# EAGLE design ATmega328p-DHT11-DS1307-LCD-StripBd (EAGLE 9.2.2)
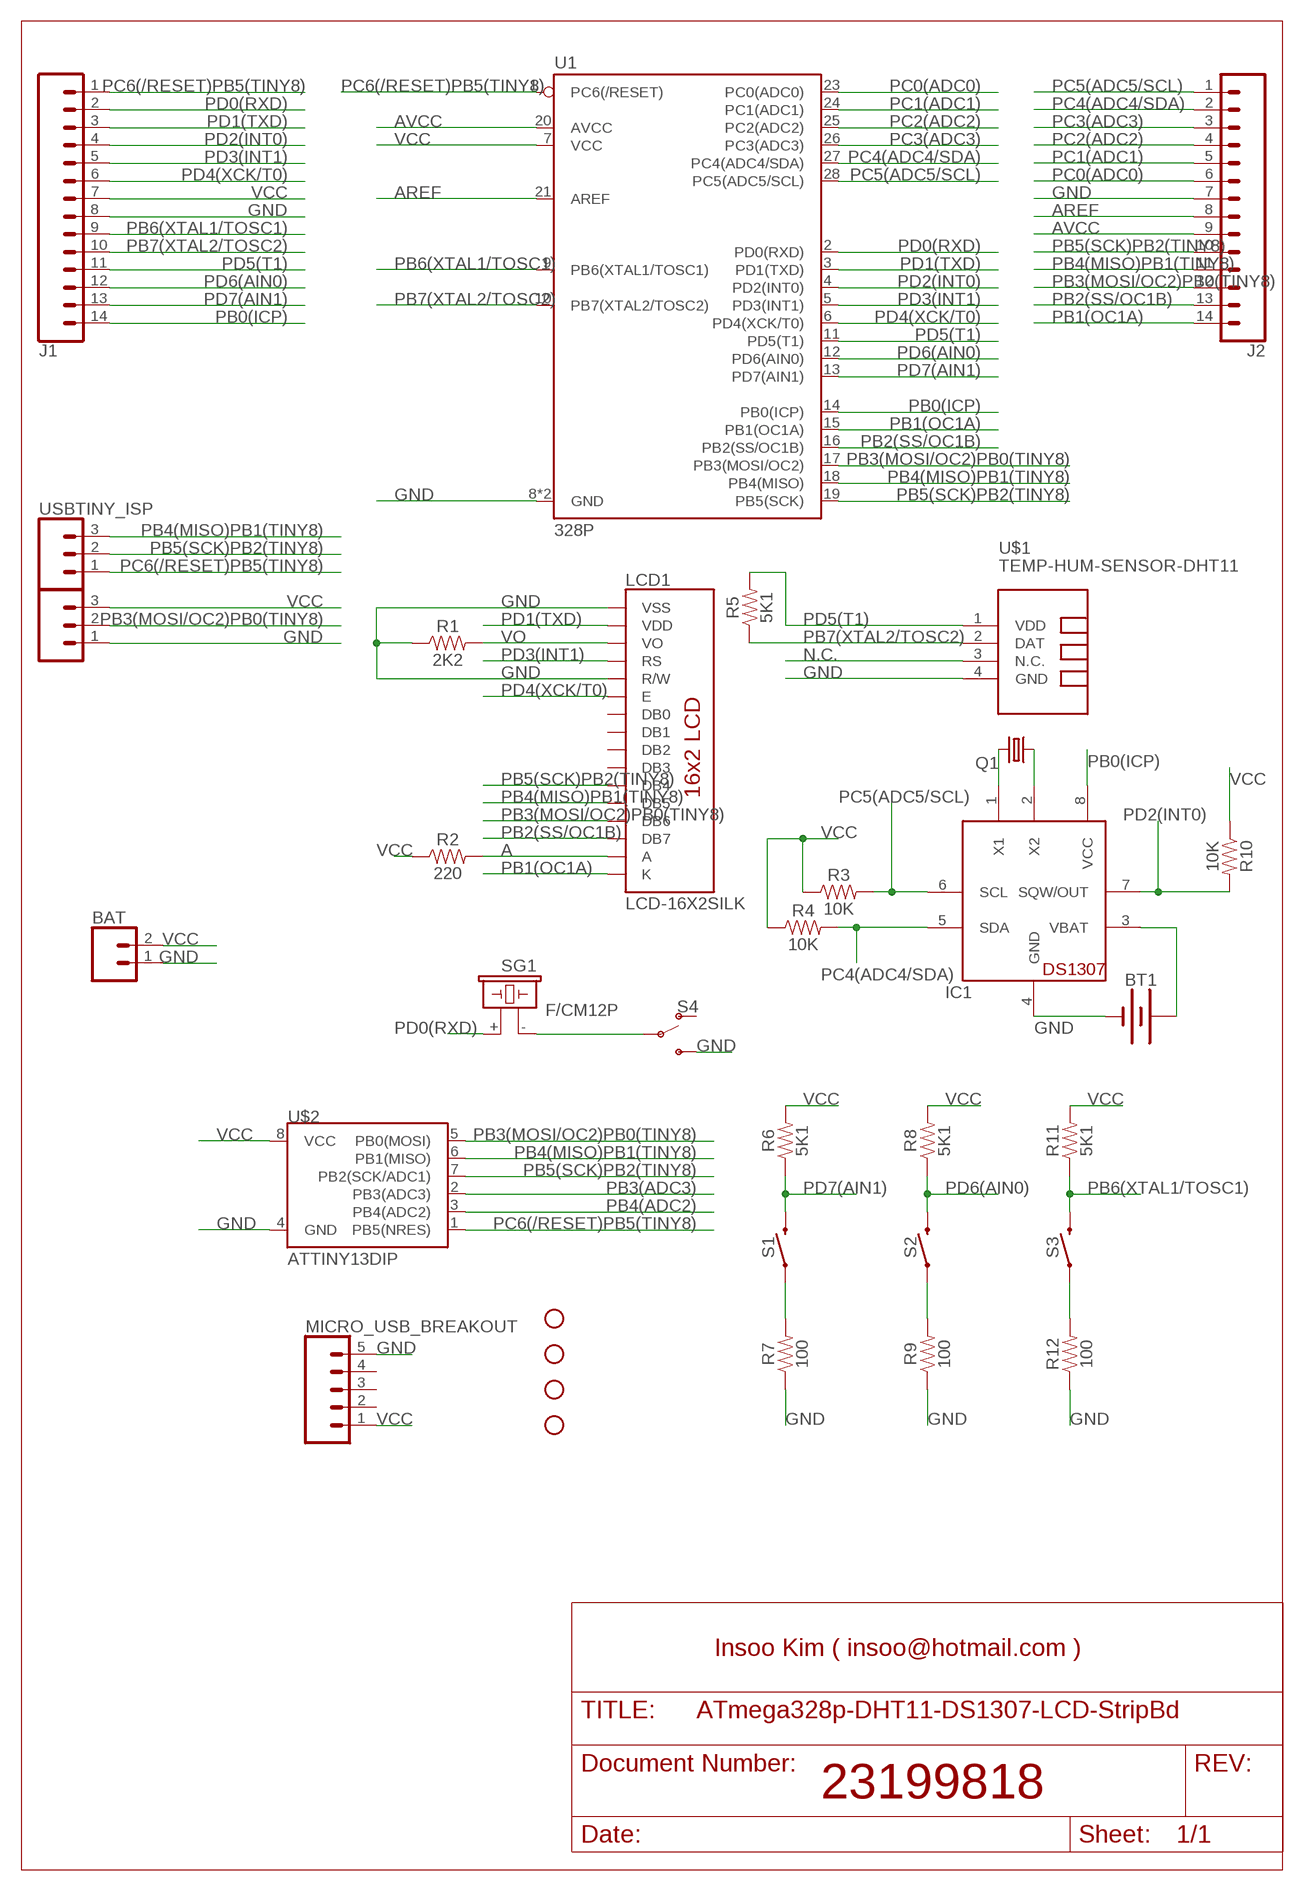
[diagram p0: schematic, sheet 1]

## Parts
BAT  CONN_02  [1X02]
BT1  BATTERY-20MM_PTH  [BATTCOM_20MM_PTH]
H1  STAND-OFF  [STAND-OFF]
H2  STAND-OFF  [STAND-OFF]
H3  STAND-OFF  [STAND-OFF]
H4  STAND-OFF  [STAND-OFF]
IC1  DS1307  [DIL08]
J1  CONN_14  [1X14]
J2  CONN_14  [1X14]
J3  455-1750-1-ND  CONN_03  [1X03]
LCD1  LCD-16X2SILK  [LCD-16X2]
MICRO_USB_BREAKOUT  CONN_05  [1X05]
Q1  CRYSTALTC26H  [TC26H]
R1  2K2  1KOHM-HORIZ-1/4W-5%  [AXIAL-0.3]
R2  220  1KOHM-HORIZ-1/4W-5%  [AXIAL-0.3]
R3  10K  1KOHM-HORIZ-1/4W-5%  [AXIAL-0.3]
R4  10K  1KOHM-HORIZ-1/4W-5%  [AXIAL-0.3]
R5  5K1  1KOHM-HORIZ-1/4W-5%  [AXIAL-0.3]
R6  5K1  1KOHM-HORIZ-1/4W-5%  [AXIAL-0.3]
R7  100  1KOHM-HORIZ-1/4W-5%  [AXIAL-0.3]
R8  5K1  1KOHM-HORIZ-1/4W-5%  [AXIAL-0.3]
R9  100  1KOHM-HORIZ-1/4W-5%  [AXIAL-0.3]
R10  10K  1KOHM-HORIZ-1/4W-5%  [AXIAL-0.3]
R11  5K1  1KOHM-HORIZ-1/4W-5%  [AXIAL-0.3]
R12  100  1KOHM-HORIZ-1/4W-5%  [AXIAL-0.3]
S1  MOMENTARY-SWITCH-SPST-PTH-12MM  [TACTILE_SWITCH_PTH_12MM]
S2  MOMENTARY-SWITCH-SPST-PTH-12MM  [TACTILE_SWITCH_PTH_12MM]
S3  MOMENTARY-SWITCH-SPST-PTH-12MM  [TACTILE_SWITCH_PTH_12MM]
S4  SWITCH-SPDT-PTH-11.6X4.0MM  [SWITCH_SPDT_PTH_11.6X4.0MM]
SG1  F/CM12P  [F/CM12P]
U1  328P  ATMEGA328P_PDIP  [DIP28]
U$1  TEMP-HUM-SENSOR-DHT11  [TEMP-HUM-SENSOR-DHT11]
U$2  ATTINY13DIP  [DIP08_MCU]
USBTINY_ISP  455-1750-1-ND  CONN_03  [1X03]

## Nets
A: LCD1.15(A) R2.P$2
AREF: J2.8 U1.21(AREF)
AVCC: J2.9 U1.20(AVCC)
GND: BAT.1 BT1.2(-) IC1.4(GND) J1.8 J2.7 J3.1 LCD1.1(VSS) LCD1.5(R/W) MICRO_USB_BREAKOUT.5 R1.P$1 R7.P$1 R9.P$1 R12.P$1 S4.3(S) U1.8(GND) U1.22(GND) U$1.4(GND) U$2.4(GND)
N$1: R12.P$2 S3.1
N$2: S4.2(P) SG1.-
N$40: R7.P$2 S1.1
N$54: IC1.2(X2) Q1.1
N$55: IC1.1(X1) Q1.2
N$56: R9.P$2 S2.1
N$58: BT1.1(+) IC1.3(VBAT)
N.C.: U$1.3(N.C.)
PB0(ICP): IC1.8(VCC) J1.14 U1.14(PB0(ICP))
PB1(OC1A): J2.14 LCD1.16(K) U1.15(PB1(OC1A))
PB2(SS/OC1B): J2.13 LCD1.14(DB7) U1.16(PB2(SS/OC1B))
PB3(ADC3): U$2.2(PB3(ADC3))
PB3(MOSI/OC2)PB0(TINY8): J2.12 J3.2 LCD1.13(DB6) U1.17(PB3(MOSI/OC2)) U$2.5(PB0(MOSI))
PB4(ADC2): U$2.3(PB4(ADC2))
PB4(MISO)PB1(TINY8): J2.11 LCD1.12(DB5) U1.18(PB4(MISO)) U$2.6(PB1(MISO)) USBTINY_ISP.3
PB5(SCK)PB2(TINY8): J2.10 LCD1.11(DB4) U1.19(PB5(SCK)) U$2.7(PB2(SCK/ADC1)) USBTINY_ISP.2
PB6(XTAL1/TOSC1): J1.9 R11.P$1 S3.3 U1.9(PB6(XTAL1/TOSC1))
PB7(XTAL2/TOSC2): J1.10 R5.P$1 U1.10(PB7(XTAL2/TOSC2)) U$1.2(DAT)
PC0(ADC0): J2.6 U1.23(PC0(ADC0))
PC1(ADC1): J2.5 U1.24(PC1(ADC1))
PC2(ADC2): J2.4 U1.25(PC2(ADC2))
PC3(ADC3): J2.3 U1.26(PC3(ADC3))
PC4(ADC4/SDA): IC1.5(SDA) J2.2 R4.P$2 U1.27(PC4(ADC4/SDA))
PC5(ADC5/SCL): IC1.6(SCL) J2.1 R3.P$2 U1.28(PC5(ADC5/SCL))
PC6(/RESET)PB5(TINY8): J1.1 U1.1(PC6(/RESET)) U$2.1(PB5(NRES)) USBTINY_ISP.1
PD0(RXD): J1.2 SG1.+ U1.2(PD0(RXD))
PD1(TXD): J1.3 LCD1.2(VDD) U1.3(PD1(TXD))
PD2(INT0): IC1.7(SQW/OUT) J1.4 R10.P$2 U1.4(PD2(INT0))
PD3(INT1): J1.5 LCD1.4(RS) U1.5(PD3(INT1))
PD4(XCK/T0): J1.6 LCD1.6(E) U1.6(PD4(XCK/T0))
PD5(T1): J1.11 R5.P$2 U1.11(PD5(T1)) U$1.1(VDD)
PD6(AIN0): J1.12 R8.P$1 S2.3 U1.12(PD6(AIN0))
PD7(AIN1): J1.13 R6.P$1 S1.3 U1.13(PD7(AIN1))
VCC: BAT.2 J1.7 J3.3 MICRO_USB_BREAKOUT.1 R2.P$1 R3.P$1 R4.P$1 R6.P$2 R8.P$2 R10.P$1 R11.P$2 U1.7(VCC) U$2.8(VCC)
VO: LCD1.3(VO) R1.P$2
Unconnected: LCD1.7(DB0) LCD1.8(DB1) LCD1.9(DB2) LCD1.10(DB3) MICRO_USB_BREAKOUT.2 MICRO_USB_BREAKOUT.3 MICRO_USB_BREAKOUT.4 S4.1(O)

## Notes on the sheet
- Insoo Kim ( insoo@hotmail.com )
- 23199818

## Library data of the parts
BAT = SparkFun-Connectors:CONN_02: Multi connection point. Often used as Generic Header-pin footprint for 0.1 inch spaced/style header connections On any of the 0.1 inch spaced packages, you can populate with these: Break Away Headers - Straight <https://www.sparkfun.com/products/116> (PRT-00116) Break Away Male Headers - Right Angle <https://www.sparkfun.com/products/553> (PRT-00553) Female Headers <https://www.sparkfun.com/products/115> (PRT-00115) Break Away Headers - Machine Pin <https://www.sparkfun.com/products/117> (PRT-00117) Break Away Female Headers - Swiss Machine Pin <https://www.sparkfun.com/products/743> (PRT-00743) For SCREWTERMINALS and SPRING TERMINALS visit here: Screw Terimnals on SparkFun.com <https://www.sparkfun.com/search/results?term=Screw+Terminals> (5mm/3.5mm/2.54mm spacing) This device is also useful as a general connection point to wire up your design to another part of your project. Our various solder wires solder well into these plated through hole pads. Hook-Up Wire - Assortment (Stranded, 22 AWG) <https://www.sparkfun.com/products/11375> (PRT-11375) Hook-Up Wire - Assortment (Solid Core, 22 AWG) <https://www.sparkfun.com/products/11367> (PRT-11367) View the entire wire category on our website here <https://www.sparkfun.com/categories/141> Special notes: Molex polarized connector foot print use with: PRT-08233 with associated crimp pins and housings. 2.54_SCREWTERM for use with PRT-10571. 3.5mm Screw Terminal footprints for PRT-08084 5mm Screw Terminal footprints for use with PRT-08432
BT1 = SparkFun-Batteries:BATTERY: Battery - Single Cell A variety of battery chemistries, sizes, and footprints. Device List: 20MM_PTH - Coin Cell Battery Holder - 20mm (PTH) <https://www.sparkfun.com/products/783> 6.8MM_PTH - Coin Cell Battery Holder - 6.8MM(SMD) <https://www.digikey.com/product-detail/en/seiko-instruments/MS621FE-FL11E/728-1057-ND/1889208?WT.srch=1&gclid=CNOQ5a6LzdQCFZS2wAodXCkE0g> 12MM_SMD - Coin Cell Battery Holder - 12mm (SMD) <https://www.sparkfun.com/products/10592> 12MM_PTH - Coin Cell Battery Holder - 12mm (PTH) <https://www.sparkfun.com/products/7948> 20MM_SMD - 20mm Coin Cell Battery Holder (SMD) (2 legs) Used on the Big Time Watch Kit <https://www.sparkfun.com/products/11734> 20MM_SMD_4LEGS - Coin Cell Battery Holder - 20mm (SMD) <https://www.sparkfun.com/products/11892> 20MM_SMD_4LEGS_OVERPASTE - Coin Cell Battery Holder - 20mm (SMD) <https://www.sparkfun.com/products/11892> (Over-paste on the legs) 24.5MM_PTH - Coin Cell Battery Holder - 24.5mm (PTH) <https://www.sparkfun.com/products/8863> 9V - 9V Battery Holder - PC Mount Used on the SparkFun SparkPunk Sound Kit <https://www.sparkfun.com/products/11177> and SparkFun SparkPunk Sequencer Kit <https://www.sparkfun.com/products/12707> 18650 - Battery Holder - 18650 (PTH) <https://www.sparkfun.com/products/13113> AA - Battery Holder - 1xAA (PTH) <https://www.sparkfun.com/products/7949> AAA - Battery Holder - 1xAAA (PTH) <https://www.sparkfun.com/products/12718> AA_KIT - Battery Holder - 1xAA (PTH) <https://www.sparkfun.com/products/7949> Special kit package - pads only have exposed copper on one side of the board. AAA_KIT - Battery Holder - 1xAAA (PTH) <https://www.sparkfun.com/products/12718> Special kit package - pads only have exposed copper on one side of the board.; PROD_ID: BATT-09031; SF_SKU: PRT-00783
H1-H4 = SparkFun-Hardware:STAND-OFF: Stand Off Drill holes for mechanically mounting via screws, standoffs, etc. Note: Use the keepout ring to avoid running the screw head into surrounding components. Variant Overviews STAND-OFF - Mechanical footprint for a #4 phillips button head screw. STAND-OFF-TIGHT - Mechanical footprint for a #4 phillips button head screw, Example SparkFun Products Screw - Phillips Head (1/4", 4-40, 10 pack) <https://www.sparkfun.com/products/10453> (PRT-10453) Screw - Phillips Head (1/2", 4-40, 10 pack) <https://www.sparkfun.com/products/10452> (PRT-10452) Screw - Phillips Head (3/4", 4-40, 10 pack) <https://www.sparkfun.com/products/10451> (PRT-10451) Screw - Phillips Head (1", 4-40, 10 pack) <https://www.sparkfun.com/products/10450> (PRT-10450)
IC1 = adafruit:DS1307: DS1307 Real time clock (RTC) with battery backup ability. Talk to it via i2c
J1 J2 = SparkFun-Connectors:CONN_14: Multi connection point. Often used as Generic Header-pin footprint for 0.1 inch spaced/style header connections On any of the 0.1 inch spaced packages, you can populate with these: Break Away Headers - Straight <https://www.sparkfun.com/products/116> (PRT-00116) Break Away Male Headers - Right Angle <https://www.sparkfun.com/products/553> (PRT-00553) Female Headers <https://www.sparkfun.com/products/115> (PRT-00115) Break Away Headers - Machine Pin <https://www.sparkfun.com/products/117> (PRT-00117) Break Away Female Headers - Swiss Machine Pin <https://www.sparkfun.com/products/743> (PRT-00743) For SCREWTERMINALS and SPRING TERMINALS visit here: Screw Terimnals on SparkFun.com <https://www.sparkfun.com/search/results?term=Screw+Terminals> (5mm/3.5mm/2.54mm spacing) This device is also useful as a general connection point to wire up your design to another part of your project. Our various solder wires solder well into these plated through hole pads. Hook-Up Wire - Assortment (Stranded, 22 AWG) <https://www.sparkfun.com/products/11375> (PRT-11375) Hook-Up Wire - Assortment (Solid Core, 22 AWG) <https://www.sparkfun.com/products/11367> (PRT-11367) View the entire wire category on our website here <https://www.sparkfun.com/categories/141> Special notes: Molex polarized connector foot print use with SKU : PRT-08231 with associated crimp pins and housings. 1MM SMD Version SKU: PRT-10208 NOTES ON THE VARIANTS LOCK and LOCK_LONGPADS... This footprint was designed to help hold the alignment of a through-hole component (i.e. 6-pin header) while soldering it into place. You may notice that each hole has been shifted either up or down by 0.005 of an inch from it's more standard position (which is a perfectly straight line). This slight alteration caused the pins (the squares in the middle) to touch the edges of the holes. Because they are alternating, it causes a "brace" to hold the component in place. 0.005 has proven to be the perfect amount of "off-center" position when using our standard breakaway headers. Although looks a little odd when you look at the bare footprint, once you have a header in there, the alteration is very hard to notice. Also,if you push a header all the way into place, it is covered up entirely on the bottom side.
J3 USBTINY_ISP = SparkFun-Connectors:CONN_03: Multi connection point. Often used as Generic Header-pin footprint for 0.1 inch spaced/style header connections On any of the 0.1 inch spaced packages, you can populate with these: Break Away Headers - Straight <https://www.sparkfun.com/products/116> (PRT-00116) Break Away Male Headers - Right Angle <https://www.sparkfun.com/products/553> (PRT-00553) Female Headers <https://www.sparkfun.com/products/115> (PRT-00115) Break Away Headers - Machine Pin <https://www.sparkfun.com/products/117> (PRT-00117) Break Away Female Headers - Swiss Machine Pin <https://www.sparkfun.com/products/743> (PRT-00743) Stackable Header - 3 Pin (Female, 0.1") <https://www.sparkfun.com/products/13875> (PRT-13875) For SCREWTERMINALS and SPRING TERMINALS visit here: Screw Terimnals on SparkFun.com <https://www.sparkfun.com/search/results?term=Screw+Terminals> (5mm/3.5mm/2.54mm spacing) This device is also useful as a general connection point to wire up your design to another part of your project. Our various solder wires solder well into these plated through hole pads. Hook-Up Wire - Assortment (Stranded, 22 AWG) <https://www.sparkfun.com/products/11375> (PRT-11375) Hook-Up Wire - Assortment (Solid Core, 22 AWG) <https://www.sparkfun.com/products/11367> (PRT-11367) View the entire wire category on our website here <https://www.sparkfun.com/categories/141> Special notes: Molex polarized connector foot print use with SKU : PRT-08232 with associated crimp pins and housings.; PROD_ID: XXX-00000
LCD1 = SparkFun-Displays:LCD-16X2: Standard text-only 16x2 parallel input LCD Basic 16 character by 2 line display. Typically utilizes the extremely common HD44780 parallel interface chipset SparkFun Products: Basic 16x2 Green <https://www.sparkfun.com/products/255> Basic 8x2 Green <https://www.sparkfun.com/products/11122>; SF_ID: LCD-00255
MICRO_USB_BREAKOUT = SparkFun-Connectors:CONN_05: Multi connection point. Often used as Generic Header-pin footprint for 0.1 inch spaced/style header connections On any of the 0.1 inch spaced packages, you can populate with these: Break Away Headers - Straight <https://www.sparkfun.com/products/116> (PRT-00116) Break Away Male Headers - Right Angle <https://www.sparkfun.com/products/553> (PRT-00553) Female Headers <https://www.sparkfun.com/products/115> (PRT-00115) Break Away Headers - Machine Pin <https://www.sparkfun.com/products/117> (PRT-00117) Break Away Female Headers - Swiss Machine Pin <https://www.sparkfun.com/products/743> (PRT-00743) For SCREWTERMINALS and SPRING TERMINALS visit here: Screw Terimnals on SparkFun.com <https://www.sparkfun.com/search/results?term=Screw+Terminals> (5mm/3.5mm/2.54mm spacing) This device is also useful as a general connection point to wire up your design to another part of your project. Our various solder wires solder well into these plated through hole pads. Hook-Up Wire - Assortment (Stranded, 22 AWG) <https://www.sparkfun.com/products/11375> (PRT-11375) Hook-Up Wire - Assortment (Solid Core, 22 AWG) <https://www.sparkfun.com/products/11367> (PRT-11367) View the entire wire category on our website here <https://www.sparkfun.com/categories/141> Special notes: Molex polarized connector foot print use with SKU : PRT-08231 with associated crimp pins and housings. 1MM SMD Version SKU: PRT-10208
Q1 = adafruit:CRYSTAL: CRYSTAL; OC_FARNELL: unknown; OC_NEWARK: unknown
R1-R12 = SparkFun-Resistors:1KOHM: 1kΩ resistor A resistor is a passive two-terminal electrical component that implements electrical resistance as a circuit element. Resistors act to reduce current flow, and, at the same time, act to lower voltage levels within circuits. - Wikipedia; PROD_ID: RES-08380; VALUE: 1k
S1-S3 = SparkFun-Switches:MOMENTARY-SWITCH-SPST: Momentary Switch (Pushbutton) - SPST Normally-open (NO) SPST momentary switches (buttons, pushbuttons). Variants PTH-12MM - 12mm square, through-hole Momentary Pushbutton Switch - 12mm Square <https://www.sparkfun.com/products/9190> (COM-09190) PTH-6.0MM, PTH-6.0MM-KIT - 6.0mm square, through-hole Mini Pushbutton Switch <https://www.sparkfun.com/products/97> (COM-00097) KIT package intended for soldering kit's - only one side of pads' copper is exposed. PTH-RIGHT-ANGLE-KIT - Right-angle, through-hole Right Angle Tactile Button <https://www.sparkfun.com/products/10791> - Used on SparkFun BigTime Watch Kit <https://www.sparkfun.com/products/11734> SMD-12MM - 12mm square, surface-mount Tactile Button - SMD (12mm) <https://www.sparkfun.com/products/12993> (COM-12993) Used on SparkFun PicoBoard <https://www.sparkfun.com/products/11888> SMD-4.5MM - 4.5mm Square Trackball Switch Used on SparkFun Blackberry Trackballer Breakout <https://www.sparkfun.com/products/13169> SMD-4.6MMX2.8MM - 4.60mm x 2.80mm, surface mount Used on SparkFun SAMD21 Mini Breakout <https://www.sparkfun.com/products/13664> SMD-5.2MM, SMD-5.2-REDUNDANT - 5.2mm square, surface-mount Mini Pushbutton Switch - SMD <https://www.sparkfun.com/products/8720> (COM-08720) Used on Arduino Pro Mini <https://www.sparkfun.com/products/11114> REDUNDANT package connects both switch circuits together SMD-6.0X3.5MM - 6.0 x 3.5mm, surface mount Momentary Reset Switch SMD <https://www.sparkfun.com/products/8229> (COM-08229) SMD-6.2MM-TALL - 6.2mm square, surface mount Tactile Button - SMD (6mm) <https://www.sparkfun.com/products/12992> Used on SparkFun Digital Sandbox <https://www.sparkfun.com/products/12651> SMD-RIGHT-ANGLE - Right-angle, surface mount Used on SparkFun Block for Intel® Edison - Arduino <https://www.sparkfun.com/products/13036>; PROD_ID: SWCH-09185; SF_SKU: COM-09190
S4 = SparkFun-Switches:SWITCH-SPDT: Single Pole, Double Throw (SPDT) Switch Single-pole, double-throw (SPDT) switch. Variant Overview SMD-AYZ0202 Surface Mount DPDT Switch <https://www.sparkfun.com/products/597> (COM-00597) Used on e.g. LilyPad Arduino USB - ATmega32U4 Board <https://www.sparkfun.com/products/12049> PTH-11.6X4.0MM SPDT Mini Power Switch <https://www.sparkfun.com/products/102> (COM-00102) Used on e.g. SparkFun Simon Says - Through-Hole Soldering Kit <https://www.sparkfun.com/products/10547> (KIT-10547) PTH-11.6X4.0MM-KIT KIT version of SPDT Mini Power Switch - Simplifies soldering by removing tStop of switch pins - only one side can be soldered. PTH-11.6X4.0MM-LOCK LOCK version of SPDT Mini Power Switch - Offset pins hold switch in place for easier soldering. SMD-RIGHT-ANGLE Surface Mount Right Angle Switch <https://www.sparkfun.com/products/10860> (COM-10860) Used on e.g. SparkFun ESP8266 Thing <https://www.sparkfun.com/products/13231>; PROD_ID: SWCH-08261; SF_SKU: COM-00102
SG1 = buzzer:F/CM12P: BUZZER Source: Buerklin; OC_FARNELL: unknown; OC_NEWARK: unknown
U1 = SparkFun-IC-Microcontroller:ATMEGA328P_PDIP: Atmel 328P Through hole ATMEGA328P uC used in the Arduino 32kb flash, 1k EEPROM, 2k SRAM Datasheet <http://www.sparkfun.com/datasheets/Components/SMD/ATMega328.pdf> SparkFun Products Storefront component: AVR 28 Pin 20MHz 32K 6A/D - ATMega328P <https://www.sparkfun.com/products/9061> (COM-09061) SparkFun Simon Says - Through-Hole Soldering Kit <https://www.sparkfun.com/products/10547> (KIT-10547) SparkFun Learn to Solder - Simon Says <https://www.sparkfun.com/products/13708> (KIT-13708) SparkFun BigTime Watch Kit <https://www.sparkfun.com/products/11734> (KIT-11734) SparkFun ClockIt <https://www.sparkfun.com/products/10930> (KIT-10930) SparkFun Serial Enabled LCD Kit <https://www.sparkfun.com/products/10097> (LCD-10097) SparkFun Simon Tilts - Through Hole Soldering Kit <https://www.sparkfun.com/products/12634> (KIT-12634) SparkFun Frequency Counter Kit <https://www.sparkfun.com/products/10140> (KIT-10140) FabFM Radio Kit <https://www.sparkfun.com/products/11043> (KIT-11043) SparkFun Binary Blaster Kit <https://www.sparkfun.com/products/12037> (KIT-12037) SparkFun Metro-Gnome <https://www.sparkfun.com/products/9236> (KIT-09236) ATmega328 with Arduino Optiboot (Uno) <https://www.sparkfun.com/products/10524> (DEV-10524); PROD_ID: IC-09136
U$1 = diy-modules:TEMP-HUM-SENSOR-DHT11: DHT11 - digital humidity & temperature sensor DHT11 datasheet available here: https://akizukidenshi.com/download/ds/aosong/DHT11.pdf Click here to find device on ebay.com <http://www.ebay.com/sch/dht11+digital+sensor>
U$2 = SparkFun-Retired:ATTINY13: ATTINY13 Retired

## Board
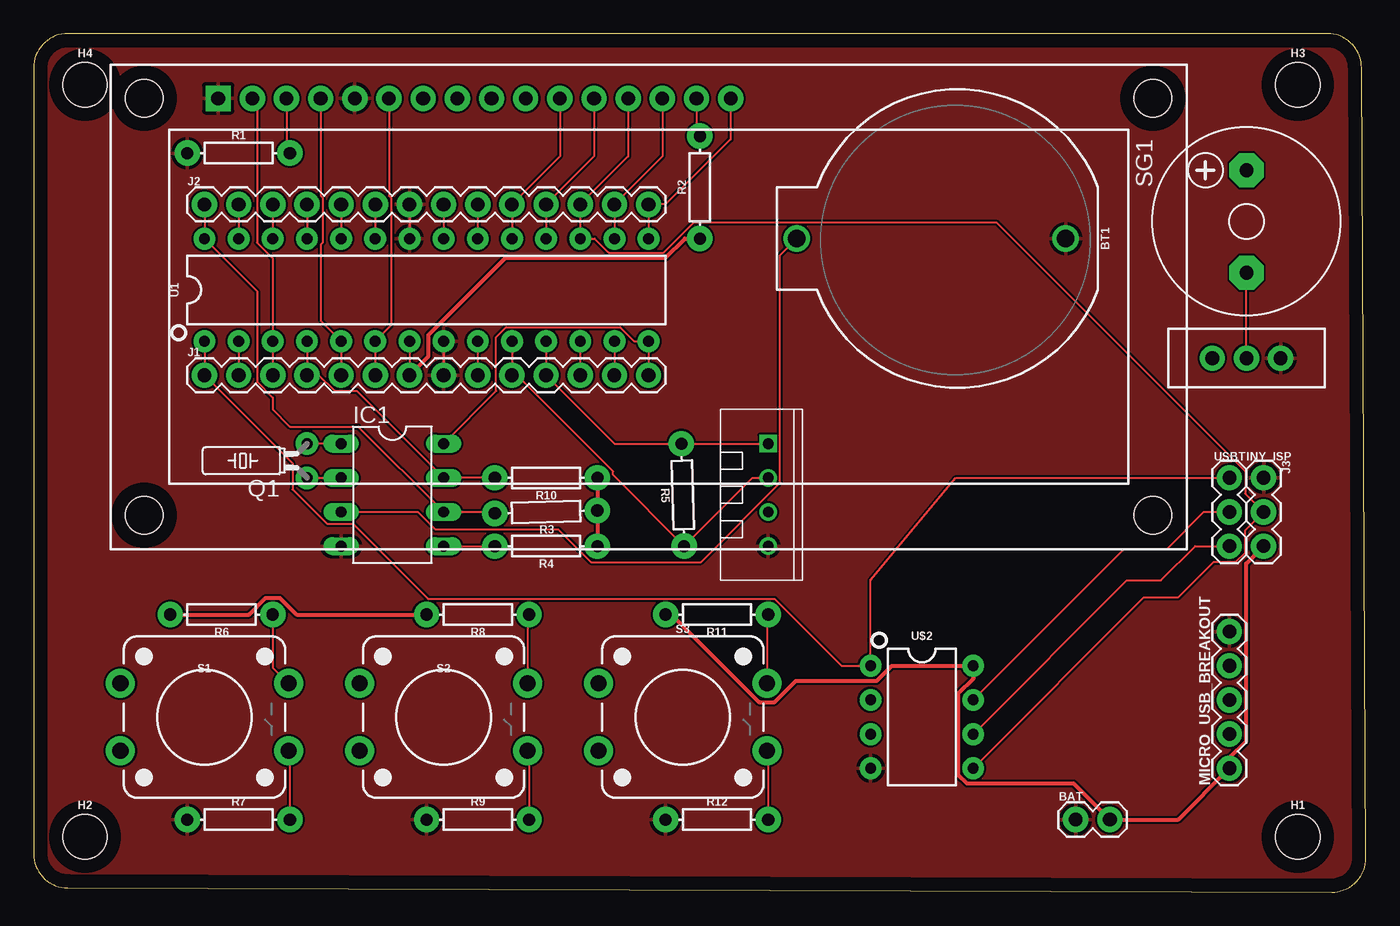
[diagram p1: board, top side]
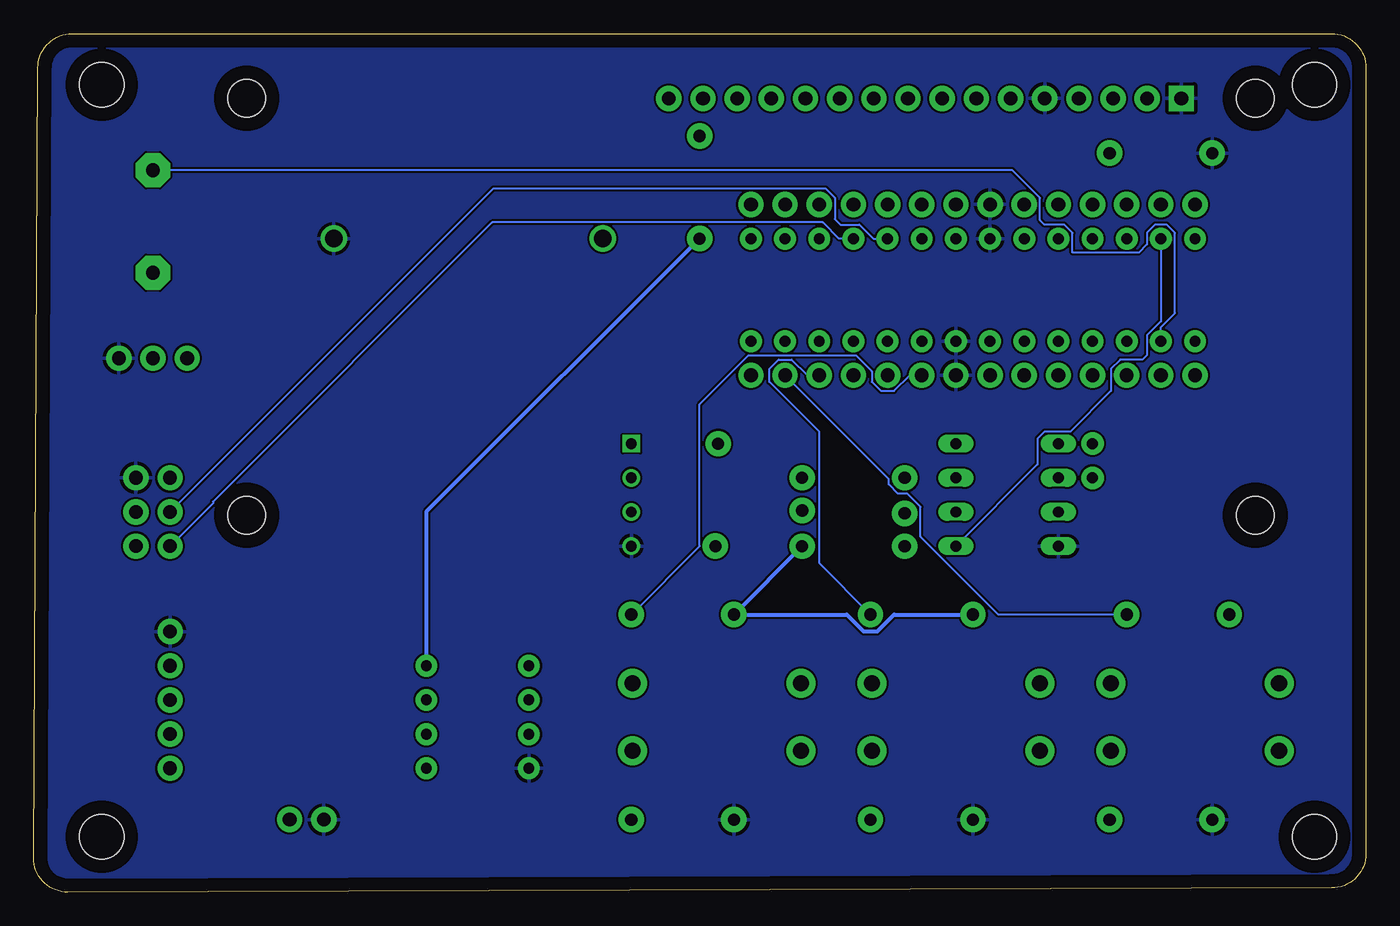
[diagram p2: board, bottom side, seen from below]

Size 99.05 x 63.81 mm. Coordinates in mm from the lower left corner, seen from the top.
Outline: 2.54,0.32 96.5,0 arc91 99.05,2.55 98.73,61.27 arc90 96.19,63.81 2.54,63.81 arc90 0,61.27 0,2.86 arc90 2.54,0.32
Copper layers (1*16): Top 0.035mm / dielectric 1.5mm / Bottom 0.035mm
Design rules "default *": minimum track width 6mil, minimum drill 0.35mm, track to track 6mil, track to pad 6mil, pad to pad 6mil, via to via 6mil, smd to smd 6mil, copper to edge 40mil, drill to drill 6mil, minimum pad ring 10mil, minimum via ring 8mil, stop-mask expansion 4mil, vias tented up to drill 0mil, thermal gap 10mil

### Footprints (pad centres in the part's own frame; a part is rotated, then mirrored left to right if it is on the bottom)
1X02 = drill 1.016 pad 1.88: 1 0,0; 2 2.54,0
BATTCOM_20MM_PTH = drill 1.3: 1 11.85,0; 2 -8.15,0
STAND-OFF = hole 3.302: 0,0
DIL08 = drill 0.813 long: 1 -3.81,-3.81; 2 -1.27,-3.81; 3 1.27,-3.81; 4 3.81,-3.81; 5 3.81,3.81; 6 1.27,3.81; 7 -1.27,3.81; 8 -3.81,3.81
1X14 = drill 1.016 pad 1.88: 1 0,0; 2 2.54,0; 3 5.08,0; 4 7.62,0; 5 10.16,0; 6 12.7,0; 7 15.24,0; 8 17.78,0; 9 20.32,0; 10 22.86,0; 11 25.4,0; 12 27.94,0; 13 30.48,0; 14 33.02,0
1X03 = drill 1.016 pad 1.88: 1 0,0; 2 2.54,0; 3 5.08,0
LCD-16X2 = drill 1.016 pad 1.88 square: 1 -32,15.5 | drill 1.016 pad 1.88: 2 -29.46,15.5; 3 -26.92,15.5; 4 -24.38,15.5; 5 -21.84,15.5; 6 -19.3,15.5; 7 -16.76,15.5; 8 -14.22,15.5; 9 -11.68,15.5; 10 -9.14,15.5; 11 -6.6,15.5; 12 -4.06,15.5; 13 -1.52,15.5; 14 1.02,15.5; 15 3.56,15.5; 16 6.1,15.5 | hole 2.8: -37.5,15.5; -37.5,-15.5; 37.5,15.5; 37.5,-15.5
1X05 = drill 1.016 pad 1.88: 1 0,0; 2 2.54,0; 3 5.08,0; 4 7.62,0; 5 10.16,0
TC26H = drill 0.813 pad 1.676: 1 -1.27,0; 2 1.27,0
AXIAL-0.3 = drill 0.9 pad 1.88: P$1 -3.81,0; P$2 3.81,0
TACTILE_SWITCH_PTH_12MM = drill 1.2 pad 2.159: 1 6.25,-2.5; 2 -6.25,-2.5; 3 6.25,2.5; 4 -6.25,2.5
SWITCH_SPDT_PTH_11.6X4.0MM = drill 1.016 pad 1.88: 1 0,2.54; 2 0,0; 3 0,-2.54
F/CM12P = drill 1.016 pad 2.54 octagon: + 3.81,0; - -3.81,0
DIP28 = drill 0.813 pad 1.626: 1 -16.51,-3.81; 2 -13.97,-3.81; 3 -11.43,-3.81; 4 -8.89,-3.81; 5 -6.35,-3.81; 6 -3.81,-3.81; 7 -1.27,-3.81; 8 1.27,-3.81; 9 3.81,-3.81; 10 6.35,-3.81; 11 8.89,-3.81; 12 11.43,-3.81; 13 13.97,-3.81; 14 16.51,-3.81; 15 16.51,3.81; 16 13.97,3.81; 17 11.43,3.81; 18 8.89,3.81; 19 6.35,3.81; 20 3.81,3.81; 21 1.27,3.81; 22 -1.27,3.81; 23 -3.81,3.81; 24 -6.35,3.81; 25 -8.89,3.81; 26 -11.43,3.81; 27 -13.97,3.81; 28 -16.51,3.81
TEMP-HUM-SENSOR-DHT11 = drill 0.8 square: 1 -3.81,0 | drill 0.8: 2 -1.27,0; 3 1.27,0; 4 3.81,0
DIP08_MCU = drill 0.813 pad 1.626: 1 -3.81,-3.81; 2 -1.27,-3.81; 3 1.27,-3.81; 4 3.81,-3.81; 5 3.81,3.81; 6 1.27,3.81; 7 -1.27,3.81; 8 -3.81,3.81

### Placement (x,y rotation side)
BAT  77.47,5.4 0 top
BT1  68.58,48.58 180 top
H1  93.98,4.13 0 top
H2  3.81,4.13 0 top
H3  93.98,60.01 0 top
H4  3.81,60.01 0 top
IC1  26.67,29.53 270 top
J1  12.7,38.42 0 top
J2  12.7,51.12 0 top
J3  91.44,30.8 270 top
LCD1  45.72,43.5 0 top
MICRO_USB_BREAKOUT  88.9,9.21 90 top
Q1  20.32,32.07 90 top
R1  15.24,54.93 0 top
R2  49.53,52.39 90 top
R3  38.1,28.26 181.6 top
R4  38.1,25.72 180 top
R5  48.26,29.53 91.6 top
R6  13.97,20.64 180 top
R7  15.24,5.4 0 top
R8  33.02,20.64 180 top
R9  33.02,5.4 0 top
R10  38.1,30.8 180 top
R11  50.8,20.64 180 top
R12  50.8,5.4 0 top
S1  12.7,13.02 0 top
S2  30.48,13.02 0 top
S3  48.26,13.02 0 top
S4  90.17,39.69 90 top
SG1  90.17,49.85 90 top
U1  29.21,44.77 0 top
U$1  54.61,29.53 270 top
U$2  66.04,13.02 270 top
USBTINY_ISP  88.9,30.8 270 top

### Tracks (layer width: path | path; a pad name or v marks a point on that pad's centre or on a via)
A
  Top 0.152: LCD1.15 49.28,56.45 R2.P$2
AREF
  Top 0.152: J2.8 U1.21
AVCC
  Top 0.152: J2.9 U1.20
GND
  Top 0.152: J2.7 U1.22 | U1.8 J1.8
  pour Top: 99.06,2.86 99.06,61.28 arc90 96.52,63.82 2.54,63.82 arc90 0,61.28 0,2.86 arc90 2.54,0.32 96.52,0.32 arc90
  pour Bottom: 99.06,2.86 99.06,61.28 arc90 96.52,63.82 2.54,63.82 arc90 0,61.28 0,2.86 arc90 2.54,0.32 96.52,0.32 arc90
N$1
  Top 0.152: S3.1 54.61,10.42 R12.P$2
N$2
  Top 0.152: S4.2 SG1.-
N$40
  Top 0.152: S1.1 19.05,10.42 R7.P$2
N$54
  Top 0.152: Q1.1 IC1.2
N$55
  Top 0.152: IC1.1 Q1.2
N$56
  Top 0.152: S2.1 36.83,10.42 R9.P$2
N$58
  Top 0.152: IC1.3 28.56,28.26 29.85,26.97 39.01,26.97 41.44,24.54 49.6,24.54 55.49,30.44 55.49,47.34 BT1.1
PB0(ICP)
  Top 0.152: J1.14 U1.14 44.65,40.96 43.61,42 35.13,42 34.39,41.27 34.39,37.25 IC1.8
PB1(OC1A)
  Top 0.152: U1.15 J2.14 46.99,51.12 51.82,55.95 LCD1.16
PB2(SS/OC1B)
  Top 0.152: U1.16 J2.13 46.74,54.68 LCD1.14
PB3(MOSI/OC2)PB0(TINY8)
  Top 0.152: LCD1.13 44.2,54.68 J2.12 U1.17 41.71,48.58 42.75,47.54 46.84,47.54 49.08,49.79 71.57,49.79 90.07,31.29 90.07,29.63 J3.2 90.07,26.89 90.07,25.24 89.38,24.55 87.73,24.55 85.09,21.91 82.55,21.91 U$2.5
PB4(MISO)PB1(TINY8)
  Top 0.152: U1.18 J2.11 41.66,54.68 LCD1.12 | U$2.6 81.28,23.18 83.82,23.18 86.36,25.72 USBTINY_ISP.3
  Bottom 0.152: USBTINY_ISP.3 85.71,28.91 85.71,29.03 64.96,49.79 40.37,49.79 39.17,48.58 U1.18
PB5(SCK)PB2(TINY8)
  Top 0.152: U1.19 J2.10 39.12,54.68 LCD1.11 | U$2.7 81.07,25.51 84.25,25.51 87,28.26 USBTINY_ISP.2
  Bottom 0.152: USBTINY_ISP.2 64.87,52.29 40.16,52.29 39.47,51.61 39.47,50.03 39.07,49.62 37.67,49.62 36.63,48.58 U1.19
PB6(XTAL1/TOSC1)
  Top 0.152: U1.9 J1.9 | R11.P$1 54.51,20.54 S3.3
  Bottom 0.152: R11.P$1 49.53,25.72 49.53,36.26 45.9,39.89 37.92,39.89 36.73,38.7 36.73,37.94 36.04,37.25 35.08,37.25 33.91,38.42 J1.9
PB7(XTAL2/TOSC2)
  Top 0.152: U1.10 J1.10 35.94,38.42 43.08,31.29 43.08,31.01 R5.P$1 53.45,30.8 U$1.2
PC0(ADC0)
  Top 0.152: J2.6 U1.23
PC1(ADC1)
  Top 0.152: J2.5 U1.24
PC2(ADC2)
  Top 0.152: J2.4 U1.25
PC3(ADC3)
  Top 0.152: J2.3 U1.26
PC4(ADC4/SDA)
  Top 0.152: J2.2 U1.27 | IC1.5 R4.P$2
  Bottom 0.152: U1.27 15.24,42.43 16.28,41.39 16.28,39.92 16.61,39.59 18.26,39.59 18.95,38.91 18.95,37.25 21.97,34.23 23.89,34.23 24.41,33.71 24.41,31.79 IC1.5
PC5(ADC5/SCL)
  Top 0.152: J2.1 U1.28 16.61,44.67 16.61,37.94 17.78,36.77 17.78,35.88 19.05,34.61 24.13,34.61 IC1.6 34.19,28.26 R3.P$2
PC6(/RESET)PB5(TINY8)
  Top 0.152: U1.1 J1.1 19.25,31.87 19.25,29.95 21.83,27.37 23.75,27.37 29.31,21.81 55.09,21.81 60.07,16.83 U$2.1 62.23,23.18 68.58,30.8 USBTINY_ISP.1
PD0(RXD)
  Top 0.152: U1.2 J1.2
  Bottom 0.152: U1.2 15.24,42 14.2,43.04 14.2,49.01 14.81,49.62 15.67,49.62 16.28,49.01 16.28,48.15 16.89,47.54 21.82,47.54 21.82,49.01 22.43,49.62 23.9,49.62 24.23,49.95 24.23,51.61 26.29,53.66 SG1.+
PD1(TXD)
  Top 0.152: J1.3 U1.3 17.78,47.11 16.61,48.28 16.61,58.65 LCD1.2
PD2(INT0)
  Top 0.152: U1.4 J1.4 21.21,38.42 22.38,37.25 24.03,37.25 IC1.7 R10.P$2
PD3(INT1)
  Top 0.152: J1.5 U1.5 21.34,42.48 21.34,48.13 21.49,48.28 21.49,51.61 21.34,51.75 LCD1.4
PD4(XCK/T0)
  Top 0.152: J1.6 U1.6 26.57,42.13 26.57,51.61 26.42,51.75 LCD1.6
PD5(T1)
  Top 0.152: U1.11 J1.11 43.18,33.34 R5.P$2 U$1.1
PD6(AIN0)
  Top 0.152: U1.12 J1.12 | R8.P$1 36.73,20.54 S2.3
  Bottom 0.152: R8.P$1 40.64,24.45 40.64,34.23 44.35,37.94 44.35,38.91 43.66,39.59 42.7,39.59 41.53,38.42 J1.12
PD7(AIN1)
  Top 0.152: U1.13 J1.13 | R6.P$1 17.78,16.69 S1.3
  Bottom 0.152: J1.13 35.46,30.7 35.46,30.32 34.77,29.63 34.1,29.63 33.11,28.64 33.11,26.43 27.32,20.64 R6.P$1
VCC
  Top 0.152: U1.7 J1.7 | R3.P$1 | R4.P$1
  Top 0.305: R10.P$1 R3.P$1 | R3.P$1 R4.P$1 | R6.P$2 16.02,20.64 17.26,21.89 18.3,21.89 19.54,20.64 R8.P$2 | R2.P$1 48.42,48.58 46.99,47.16 35.1,47.16 29.36,41.42 29.36,39.84 J1.7 | J3.3 90.14,24.43 90.14,23.18 90.14,11.24 88.9,9.99 MICRO_USB_BREAKOUT.1 85.09,5.4 BAT.2 77.32,8.09 69.39,8.09 68.73,8.75 68.73,14.75 69.85,15.87 U$2.8 63.81,16.83 62.69,15.71 56.66,15.71 55.08,14.14 53.94,14.14 47.43,20.64 R11.P$2
  Bottom 0.305: R4.P$1 R11.P$2 38.59,20.64 37.35,19.4 36.31,19.4 35.07,20.64 R8.P$2 | R2.P$1 69.85,28.26 U$2.8
VO
  Top 0.152: LCD1.3 18.8,55.18 R1.P$2